# EAGLE design ESP8266_MainBoard (EAGLE 7.3.0)
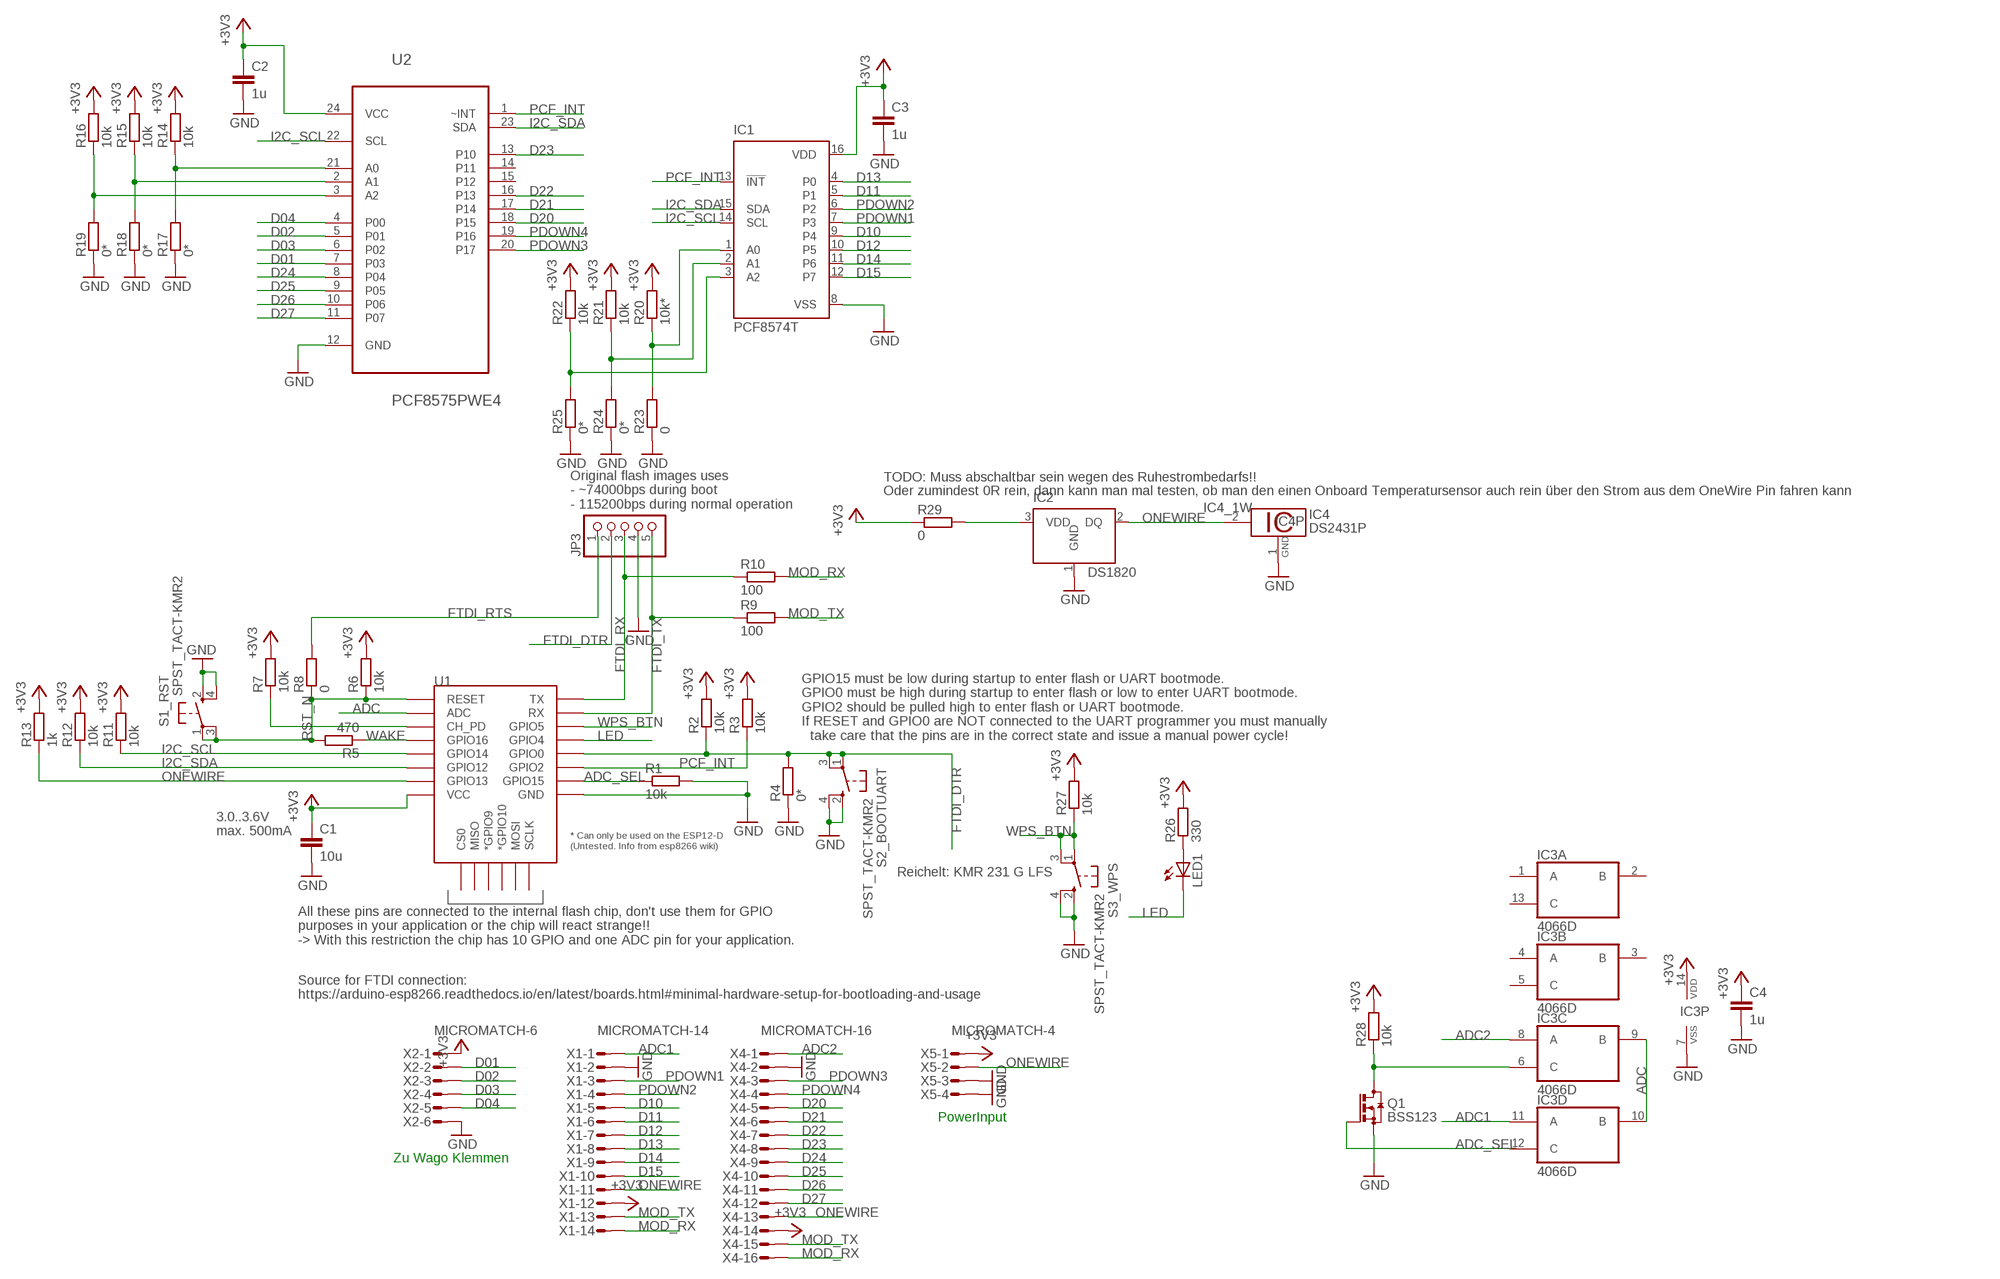
[diagram p0: schematic, sheet 1]

## Parts
C1  10u  C-EUC0805  [C0805]
C2  1u  C-EUC0402  [C0402]
C3  1u  C-EUC0402  [C0402]
C4  1u  C-EUC0402  [C0402]
IC1  PCF8574T  [SO16W]
IC2  DS1820  [TO-92]
IC3  4066D  [SO14]
IC4  DS2431P  [TSOC6]
JP3  PINHD-1X5  [1X05]
LED1  LEDCHIP-LED0603  [CHIP-LED0603]
Q1  BSS123  [SOT23]
R1  10k  R-EU_R0402  [R0402]
R2  10k  R-EU_R0402  [R0402]
R3  10k  R-EU_R0402  [R0402]
R4  0*  R-EU_R0402  [R0402]
R5  470  R-EU_R0402  [R0402]
R6  10k  R-EU_R0402  [R0402]
R7  10k  R-EU_R0402  [R0402]
R8  0  R-EU_R0402  [R0402]
R9  100  R-EU_R0402  [R0402]
R10  100  R-EU_R0402  [R0402]
R11  10k  R-EU_R0402  [R0402]
R12  10k  R-EU_R0402  [R0402]
R13  1k  R-EU_R0402  [R0402]
R14  10k  R-EU_R0402  [R0402]
R15  10k  R-EU_R0402  [R0402]
R16  10k  R-EU_R0402  [R0402]
R17  0*  R-EU_R0402  [R0402]
R18  0*  R-EU_R0402  [R0402]
R19  0*  R-EU_R0402  [R0402]
R20  10k*  R-EU_R0402  [R0402]
R21  10k  R-EU_R0402  [R0402]
R22  10k  R-EU_R0402  [R0402]
R23  0  R-EU_R0402  [R0402]
R24  0*  R-EU_R0402  [R0402]
R25  0*  R-EU_R0402  [R0402]
R26  330  R-EU_R0402  [R0402]
R27  10k  R-EU_R0402  [R0402]
R28  10k  R-EU_R0402  [R0402]
R29  0  R-EU_R0402  [R0402]
S1_RST  SPST_TACT-KMR2  [KMR2]
S2_BOOTUART  SPST_TACT-KMR2  [KMR2]
S3_WPS  SPST_TACT-KMR2  [KMR2]
U1  ESP12ESMD  [ESP12E-SMD]
U2  PCF8575PWE4  [SOP65P640X120-24N]
X1  MICROMATCH-14  [MICROMATCH-14]
X2  MICROMATCH-6  [MICROMATCH-6]
X4  MICROMATCH-16  [MICROMATCH-16]
X5  MICROMATCH-4  [MICROMATCH-4]

## Nets
+3V3: C1.1 C2.1 C3.1 C4.1 IC1.16(VDD) IC3.14(P:VDD) R2.2 R3.2 R6.2 R7.2 R11.2 R12.2 R13.2 R14.2 R15.2 R16.2 R20.2 R21.2 R22.2 R26.2 R27.2 R28.2 R29.1 U1.VCC U2.24(VCC) X1.12 X2.1 X4.14 X5.1
ADC: IC3.9(C:B) IC3.10(D:B) U1.ADC
ADC1: IC3.11(D:A) X1.1
ADC2: IC3.8(C:A) X4.1
ADC_SEL: IC3.12(D:C) Q1.1(G) R1.1 U1.GPIO15
D01: U2.7(P03) X2.2
D02: U2.5(P01) X2.3
D03: U2.6(P02) X2.4
D04: U2.4(P00) X2.5
D10: IC1.9(P4) X1.5
D11: IC1.5(P1) X1.6
D12: IC1.10(P5) X1.7
D13: IC1.4(P0) X1.8
D14: IC1.11(P6) X1.9
D15: IC1.12(P7) X1.10
D20: U2.18(P15) X4.5
D21: U2.17(P14) X4.6
D22: U2.16(P13) X4.7
D23: U2.13(P10) X4.8
D24: U2.8(P04) X4.9
D25: U2.9(P05) X4.10
D26: U2.10(P06) X4.11
D27: U2.11(P07) X4.12
FTDI_DTR: JP3.2 R2.1 R4.2 S2_BOOTUART.1(P) S2_BOOTUART.3(P1) U1.GPIO0
FTDI_RTS: JP3.1 R8.2
FTDI_RX: JP3.3 R10.1 U1.TXD0(TX)
FTDI_TX: JP3.5 R9.1 U1.RXD0(RX)
GND: C1.2 C2.2 C3.2 C4.2 IC1.8(VSS) IC2.1(GND) IC3.7(P:VSS) IC4.1(GND) JP3.4 Q1.2(S) R1.2 R4.1 R17.1 R18.1 R19.1 R23.1 R24.1 R25.1 S1_RST.2(S) S1_RST.4(S1) S2_BOOTUART.2(S) S2_BOOTUART.4(S1) S3_WPS.2(S) S3_WPS.4(S1) U1.GND U2.12(GND) X1.2 X2.6 X4.2 X5.3 X5.4
I2C_SCL: IC1.14(SCL) R11.1 U1.GPIO14 U2.22(SCL)
I2C_SDA: IC1.15(SDA) R12.1 U1.GPIO12 U2.23(SDA)
LED: LED1.C U1.GPIO4
MOD_RX: R10.2 X1.14 X4.16
MOD_TX: R9.2 X1.13 X4.15
N$1: IC3.6(C:C) Q1.3(D) R28.1
N$2: R14.1 R17.2 U2.21(A0)
N$3: R15.1 R18.2 U2.2(A1)
N$4: R7.1 U1.CH_PD
N$5: IC2.3(VDD) R29.2
N$21: R16.1 R19.2 U2.3(A2)
N$25: IC1.1(A0) R20.1 R23.2
N$26: IC1.2(A1) R21.1 R24.2
N$27: IC1.3(A2) R22.1 R25.2
N$33: LED1.A R26.1
ONEWIRE: IC2.2(DQ) IC4.2(1W) R13.1 U1.GPIO13 X1.11 X4.13 X5.2
PCF_INT: IC1.13(!INT) R3.1 U1.GPIO2 U2.1(~INT)
PDOWN1: IC1.7(P3) X1.3
PDOWN2: IC1.6(P2) X1.4
PDOWN3: U2.20(P17) X4.3
PDOWN4: U2.19(P16) X4.4
RST_N: R5.2 R6.1 R8.1 S1_RST.1(P) S1_RST.3(P1) U1.RESET
WAKE: R5.1 U1.GPIO16
WPS_BTN: R27.1 S3_WPS.1(P) S3_WPS.3(P1) U1.GPIO5
Unconnected: IC3.1(A:A) IC3.2(A:B) IC3.3(B:B) IC3.4(B:A) IC3.5(B:C) IC3.13(A:C) U1.CS0 U1.GPIO9(*GPIO9) U1.GPIO10(*GPIO10) U1.MISO U1.MOSI U1.SCLK U2.14(P11) U2.15(P12)

## Notes on the sheet
- TODO: Muss abschaltbar sein wegen des Ruhestrombedarfs!!
- Oder zumindest 0R rein, dann kann man mal testen, ob man den einen Onboard Temperatursensor auch rein über den Strom aus dem OneWire Pin fahren kann
- Original flash images uses
  - ~74000bps during boot
  - 115200bps during normal operation
- GPIO15 must be low during startup to enter flash or UART bootmode.
  GPIO0 must be high during startup to enter flash or low to enter UART bootmode.
  GPIO2 should be pulled high to enter flash or UART bootmode.
  If RESET and GPIO0 are NOT connected to the UART programmer you must manually
    take care that the pins are in the correct state and issue a manual power cycle!
- 3.0..3.6V
  max. 500mA
- Reichelt: KMR 231 G LFS
- All these pins are connected to the internal flash chip, don't use them for GPIO
  purposes in your application or the chip will react strange!!
  -> With this restriction the chip has 10 GPIO and one ADC pin for your application.
- Source for FTDI connection:
  https://arduino-esp8266.readthedocs.io/en/latest/boards.html#minimal-hardware-setup-for-bootloading-and-usage
- PowerInput
- Zu Wago Klemmen

## Library data of the parts
C1-C4 = rcl:C-EU: CAPACITOR, European symbol
IC1 = micro-philips:PCF8574: I2C-Bus Remote 8-bit I/O expander http://www.semiconductors.philips.com/acrobat_download/datasheets/PCF8574_4.pdf; MPN: PCF8574T/3,512; OC_FARNELL: 1201255; OC_NEWARK: 70R6870
IC2 = DS1820:DS1820: DS1820 - 1-Wire Digital Thermometer
IC3 = 40xx:4066: Quad bilateral ANALOG SWITCH
IC4 = 1wire:DS2431: 1024-Bit EEPROM This chip provides a 4x256 Bit EEPROM, which can be programmed@5V. Write protection and OTP emulation are available, too. Author: Jan Kandziora <jjj@gmx.de>
JP3 = pinhead:PINHD-1X5: PIN HEADER
LED1 = adafruit:LED: LED OSRAM: - CHIPLED LG R971, LG N971, LY N971, LG Q971, LY Q971, LO R971, LY R971 LH N974, LH R974 LS Q976, LO Q976, LY Q976 LO Q996 - Hyper CHIPLED LW Q18S LB Q993, LB Q99A, LB R99A - SideLED LS A670, LO A670, LY A670, LG A670, LP A670 LB A673, LV A673, LT A673, LW A673 LH A674 LY A675 LS A676, LA A676, LO A676, LY A676, LW A676 LS A679, LY A679, LG A679 - Hyper Micro SIDELED® LS Y876, LA Y876, LO Y876, LY Y876 LT Y87S - SmartLED LW L88C, LW L88S LB L89C, LB L89S, LG L890 LS L89K, LO L89K, LY L89K LS L896, LA L896, LO L896, LY L896 - TOPLED LS T670, LO T670, LY T670, LG T670, LP T670 LSG T670, LSP T670, LSY T670, LOP T670, LYG T670 LG T671, LOG T671, LSG T671 LB T673, LV T673, LT T673, LW T673 LH T674 LS T676, LA T676, LO T676, LY T676, LB T676, LH T676, LSB T676, LW T676 LB T67C, LV T67C, LT T67C, LS T67K, LO T67K, LY T67K, LW E67C LS E67B, LA E67B, LO E67B, LY E67B, LB E67C, LV E67C, LT E67C LW T67C LS T679, LY T679, LG T679 LS T770, LO T770, LY T770, LG T770, LP T770 LB T773, LV T773, LT T773, LW T773 LH T774 LS E675, LA E675, LY E675, LS T675 LS T776, LA T776, LO T776, LY T776, LB T776 LHGB T686 LT T68C, LB T68C - Hyper Mini TOPLED® LB M676 - Mini TOPLED Santana® LG M470 LS M47K, LO M47K, LY M47K Source: http://www.osram.convergy.de/
Q1 = transistor-small-signal:BSS123: N-CHANNEL MOS FET
R1-R29 = rcl:R-EU_: RESISTOR, European symbol
S1_RST S2_BOOTUART S3_WPS = adafruit:SPST_TACT: SMT 6mm switch, EVQQ2 series http://www.ladyada.net/library/eagle
U1 = esp8266modules:ESP12E: ESP12E Module
U2 = PCF8575PWE4:PCF8575PWE4: REMOTE 16-BIT I2C AND SMBus I/O EXPANDER; AVAILABILITY: Good; DESCRIPTION: emote 16-Bit I2C and SMBus I/O Expander with Interrupt Output 24-TSSOP -40 to 85; MF: Texas Instruments; MP: PCF8575PWE4; PACKAGE: TSSOP-24 Texas Instruments; PRICE: 1.39 USD
X1 = con-amp-micromatch:MICROMATCH-14: MicroMaTch 14 8-215464-4 / 1-215464-4 Drawing Number C-215464 DDEController.pdf; MF: FARNELL; MPN: 8-215464-4; OC_FARNELL: 3784678; OC_NEWARK: 19J6431
X2 = con-amp-micromatch:MICROMATCH-6: MicroMaTch 6 7-215464-6 / 0-215464-6 Drawing Number C-215464 DDEController.pdf; MPN: 7-215464-6; OC_FARNELL: 3784630; OC_NEWARK: 19R8125
X4 = con-amp-micromatch:MICROMATCH-16: MicroMaTch 16 8-215464-6 / 1-215464-6 Drawing Number C-215464 DDEController.pdf; MF: FARNELL; MPN: 8-215464-6; OC_FARNELL: 3784680; OC_NEWARK: 26H3309
X5 = con-amp-micromatch:MICROMATCH-4: MicroMaTch 4 7-215464-4 / 0-215464-4 Drawing Number C-215464 DDEController.pdf; MPN: 7-215464-4; OC_FARNELL: 3784629; OC_NEWARK: 19R8124

## Board
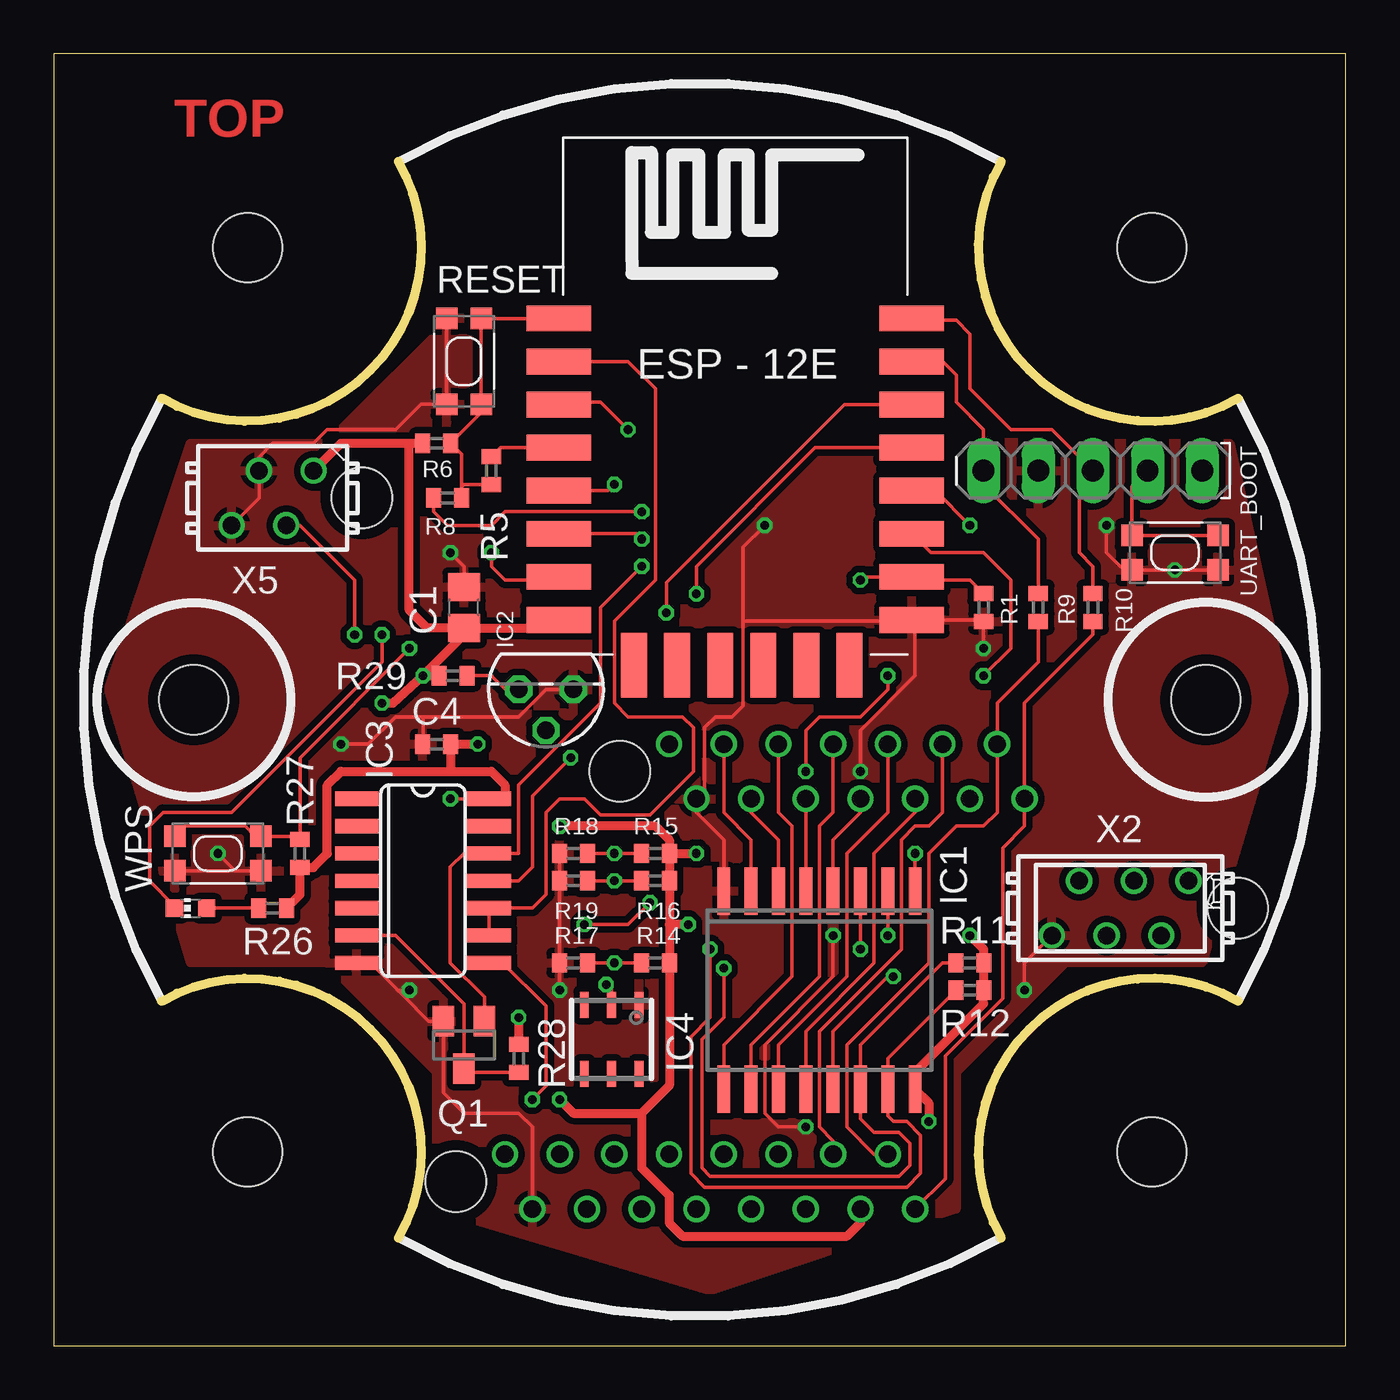
[diagram p1: board, top side]
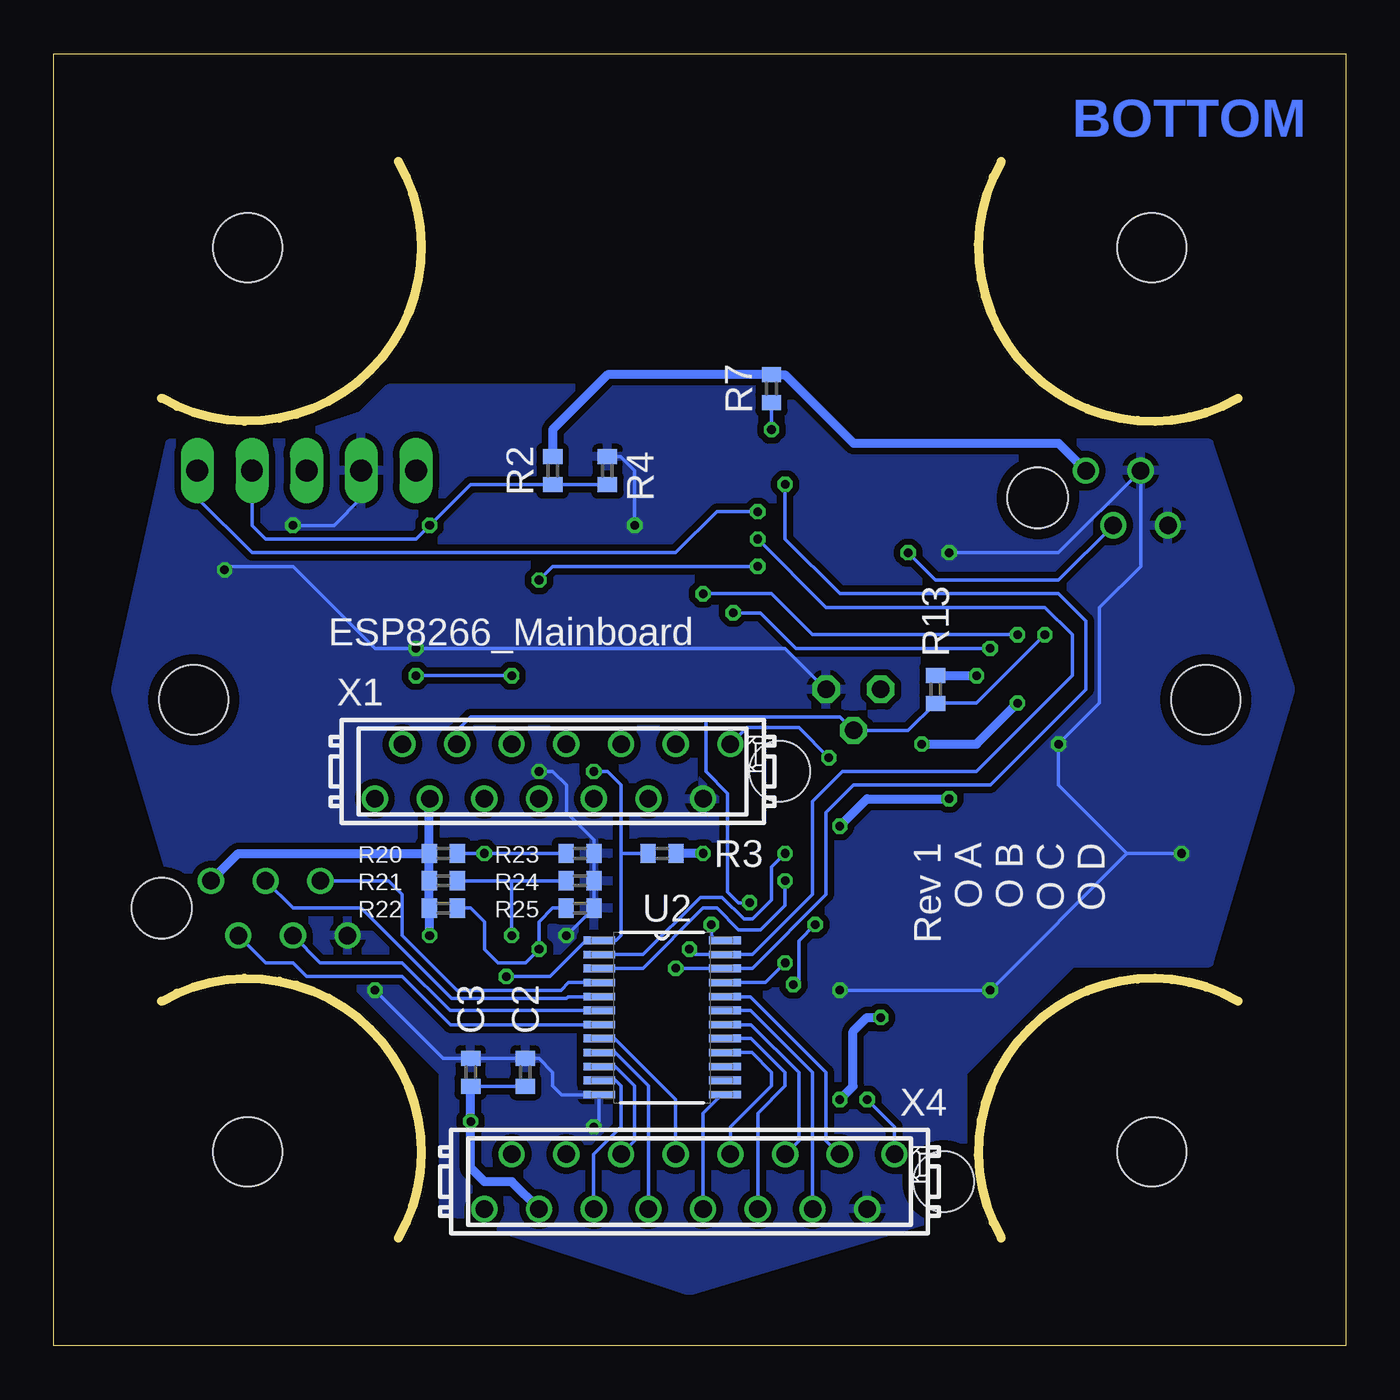
[diagram p2: board, bottom side, seen from below]

Size 60 x 60 mm. Coordinates in mm from the lower left corner, seen from the top.
Outline: 0,0 60,0 60,60 0,60 0,0
Copper layers (1*16): Top 0.035mm / dielectric 1.6mm / Bottom 0.035mm
Design rules "Elecrow_2-layer_PCB_eagle_rule": minimum track width 6mil, minimum drill 12mil, track to track 6mil, track to pad 6mil, pad to pad 6mil, via to via 8mil, smd to smd 0mil, copper to edge 20mil, drill to drill 10mil, minimum pad ring 6mil, minimum via ring 6mil, stop-mask expansion 0mil, vias tented up to drill 100mil, thermal gap 10mil
Holes 3.2 mm at 9,51 51,51 51,9 9,9 6.5,30 53.5,30
Holes 2.8 mm at 14.3,39.37 54.99,20.32 26.29,26.67 18.67,7.62
Milling: 4 lines

### Footprints (pad centres in the part's own frame; a part is rotated, then mirrored left to right if it is on the bottom)
C0805 = smd 1.3 x 1.5: 1 -0.95,0; 2 0.95,0
C0402 = smd 0.7 x 0.9: 1 -0.65,0; 2 0.65,0
SO16W = smd 0.6 x 2.2: 1 -4.445,-4.6; 2 -3.175,-4.6; 3 -1.905,-4.6; 4 -0.635,-4.6; 5 0.635,-4.6; 6 1.905,-4.6; 7 3.175,-4.6; 8 4.445,-4.6; 9 4.445,4.6; 10 3.175,4.6; 11 1.905,4.6; 12 0.635,4.6; 13 -0.635,4.6; 14 -1.905,4.6; 15 -3.175,4.6; 16 -4.445,4.6
TO-92 = drill 0.813 pad 1.27 octagon: 1 -1.27,0; 2 0,1.905; 3 1.27,0
SO14 = smd 0.66 x 2.032: 1 -3.81,-3.073; 2 -2.54,-3.073; 3 -1.27,-3.073; 4 0,-3.073; 5 1.27,-3.073; 6 2.54,-3.073; 7 3.81,-3.073; 8 3.81,3.073; 9 2.54,3.073; 10 1.27,3.073; 11 0,3.073; 12 -1.27,3.073; 13 -2.54,3.073; 14 -3.81,3.073
TSOC6 = smd 0.406 x 1.219: 1 -1.27,-1.6; 2 0,-1.6; 3 1.27,-1.6; 4 1.27,1.6; 5 0,1.6; 6 -1.27,1.6
1X05 = drill 1.016 long: 1 -5.08,0; 2 -2.54,0; 3 0,0; 4 2.54,0; 5 5.08,0
CHIP-LED0603 = smd 0.8 x 0.8: A 0,-0.75; C 0,0.75
SOT23 = smd 1 x 1.4: 1 -0.95,-1.1; 2 0.95,-1.1; 3 0,1.1
R0402 = smd 0.7 x 0.9: 1 -0.65,0; 2 0.65,0
KMR2 = smd 1 x 1: 1 2,0.8; 2 2,-0.8; 3 -2,0.8; 4 -2,-0.8
ESP12E-SMD = smd 3 x 1.2: ADC -8.3,3.8; CH_PD -8.3,1.8; GND 8.1,-8.2; GPIO0 8.1,-2.2; GPIO2 8.1,-4.2; GPIO4 8.1,-0.2; GPIO5 8.1,1.8; GPIO12 -8.3,-4.2; GPIO13 -8.3,-6.2; GPIO14 -8.3,-2.2; GPIO15 8.1,-6.2; GPIO16 -8.3,-0.2; RESET -8.3,5.8; RXD0 8.1,3.8; TXD0 8.1,5.8; VCC -8.3,-8.2 | smd 1.2 x 3: CS0 -4.8,-10.3; GPIO9 -0.8,-10.3; GPIO10 1.2,-10.3; MISO -2.8,-10.3; MOSI 3.2,-10.3; SCLK 5.2,-10.3
SOP65P640X120-24N = smd 1.473 x 0.356: 1 -2.921,3.581; 2 -2.921,2.921; 3 -2.921,2.286; 4 -2.921,1.626; 5 -2.921,0.965; 6 -2.921,0.33; 7 -2.921,-0.33; 8 -2.921,-0.965; 9 -2.921,-1.626; 10 -2.921,-2.286; 11 -2.921,-2.921; 12 -2.921,-3.581; 13 2.921,-3.581; 14 2.921,-2.921; 15 2.921,-2.286; 16 2.921,-1.626; 17 2.921,-0.965; 18 2.921,-0.33; 19 2.921,0.33; 20 2.921,0.965; 21 2.921,1.626; 22 2.921,2.286; 23 2.921,2.921; 24 2.921,3.581
MICROMATCH-14 = drill 0.813: 1 8.255,1.27; 2 6.985,-1.27; 3 5.715,1.27; 4 4.445,-1.27; 5 3.175,1.27; 6 1.905,-1.27; 7 0.635,1.27; 8 -0.635,-1.27; 9 -1.905,1.27; 10 -3.175,-1.27; 11 -4.445,1.27; 12 -5.715,-1.27; 13 -6.985,1.27; 14 -8.255,-1.27
MICROMATCH-6 = drill 0.813: 1 3.175,1.27; 2 1.905,-1.27; 3 0.635,1.27; 4 -0.635,-1.27; 5 -1.905,1.27; 6 -3.175,-1.27
MICROMATCH-16 = drill 0.813: 1 9.525,1.27; 2 8.255,-1.27; 3 6.985,1.27; 4 5.715,-1.27; 5 4.445,1.27; 6 3.175,-1.27; 7 1.905,1.27; 8 0.635,-1.27; 9 -0.635,1.27; 10 -1.905,-1.27; 11 -3.175,1.27; 12 -4.445,-1.27; 13 -5.715,1.27; 14 -6.985,-1.27; 15 -8.255,1.27; 16 -9.525,-1.27
MICROMATCH-4 = drill 0.813: 1 1.905,1.27; 2 0.635,-1.27; 3 -0.635,1.27; 4 -1.905,-1.27

### Placement (x,y rotation side)
C1  19.05,34.29 90 top
C2  38.1,12.7 90 bottom
C3  40.64,12.7 90 bottom
C4  17.78,27.94 180 top
IC1  35.56,16.51 180 top
IC2  22.86,30.48 180 top
IC3  17.14,21.59 270 top
IC4  25.91,14.22 180 top
JP3  48.26,40.64 180 top
LED1  6.35,20.32 90 top
Q1  19.05,13.97 180 top
R1  43.18,34.29 270 top
R2  36.83,40.64 90 bottom
R3  31.75,22.86 0 bottom
R4  34.29,40.64 270 bottom
R5  20.32,40.64 270 top
R6  17.78,41.91 180 top
R7  26.67,44.45 90 bottom
R8  18.29,39.37 180 top
R9  45.72,34.29 270 top
R10  48.26,34.29 270 top
R11  42.55,17.78 0 top
R12  42.55,16.51 0 top
R13  19.05,30.48 90 bottom
R14  27.94,17.78 0 top
R15  27.94,22.86 0 top
R16  27.94,21.59 0 top
R17  24.13,17.78 0 top
R18  24.13,22.86 0 top
R19  24.13,21.59 0 top
R20  41.91,22.86 180 bottom
R21  41.91,21.59 180 bottom
R22  41.91,20.32 180 bottom
R23  35.56,22.86 180 bottom
R24  35.56,21.59 180 bottom
R25  35.56,20.32 180 bottom
R26  10.16,20.32 0 top
R27  11.43,22.86 270 top
R28  21.59,13.34 90 top
R29  18.54,31.11 0 top
S1_RST  19.05,45.72 270 top
S2_BOOTUART  52.07,36.83 0 top
S3_WPS  7.62,22.86 0 top
U1  31.75,41.91 0 top
U2  31.75,15.24 0 bottom
X1  36.83,26.67 0 bottom
X2  49.53,20.32 0 top
X4  30.48,7.62 0 bottom
X5  10.16,39.37 0 top

### Tracks (layer width: path | path; a pad name or v marks a point on that pad's centre or on a via)
+3V3  (via drill 0.4)
  Top 0.152: IC1.16 40.01,12.7 | 43.18,16.5 R12.2 | R26.2 10.81,20.34 | 20.95,25.5 IC3.14 v18.41,25.4 | 18.43,26.68 18.41,26.67 | 23.08,33.34 U1.VCC | C1.1 19.05,33.02
  Top 0.406: 40.01,12.7 43.18,15.88 43.18,16.5 | R12.2 R11.2 43.2,18.4 v42.55,19.05 | IC1.16 40.64,11.28 v40.64,10.41 | 27.3,10.79 28.59,12.08 R14.2 28.59,19.56 | 27.3,10.79 27.3,8.26 28.57,6.99 28.57,5.71 29.21,5.08 36.83,5.08 37.47,5.71 X4.14 | v23.5,11.43 24.13,10.79 27.3,10.79 | 28.59,19.56 R16.2 R15.2 | 10.81,20.34 11.43,20.95 R27.2 12.05,22.21 12.7,22.86 12.7,26.04 13.34,26.67 18.41,26.67 20.32,26.67 20.95,26.04 20.95,25.5 | 18.43,26.68 C4.1 v19.68,27.94 | 23.08,33.34 C1.1 17.33,33.34 16.51,34.16 16.51,41.91 | R15.2 v29.84,22.86 | v23.5,24.13 27.94,24.13 28.59,23.48 R15.2 | v17.14,31.11 R29.1 | 19.05,33.02 v17.14,31.11 | X5.1 13.34,41.91 16.51,41.91 | 16.51,41.91 R6.2 | v15.24,29.84 15.75,29.84 v17.14,31.11 | v21.59,15.24 R28.2 | v29.46,19.56 28.59,19.56
  Bottom 0.152: 42.55,20.3 R22.2 | 42.56,25.39 X1.12 | C2.1 C3.1 | 19.07,31.11 R13.2 19.04,31.11 | U2.24 29.23,18.82 29.46,19.05 v29.46,19.56
  Bottom 0.406: v42.55,19.05 42.55,20.3 | R22.2 R21.2 R20.2 | R20.2 42.56,25.39 | X2.1 51.44,22.86 R20.2 | X4.14 38.73,7.62 40.01,7.62 40.64,8.26 v40.64,10.41 C3.1 | v23.5,11.43 22.88,12.05 22.88,14.59 22.23,15.24 v21.59,15.24 | R2.2 36.83,42.55 34.27,45.1 R7.2 26.05,45.1 22.86,41.91 13.34,41.91 X5.1 | v29.84,22.86 R3.2 | v23.5,24.13 22.23,25.4 v18.41,25.4 | 19.04,31.11 v17.14,31.11 | v19.68,27.94 17.14,27.94 v15.24,29.84
ADC
  Top 0.152: IC3.9 IC3.10 22.23,20.32 22.86,20.95 22.86,24.77 23.5,25.4 24.64,25.4 25.4,24.64 27.69,24.64 29.72,26.67 29.72,28.7 29.21,29.21 26.67,29.21 26.04,29.84 26.04,33.66 27.94,35.56 27.94,44.45 26.68,45.71 U1.ADC
ADC1  (via drill 0.4)
  Top 0.152: IC3.11 21.59,21.59 22.23,22.23 22.23,25.53 v24,27.3
  Bottom 0.152: v24,27.3 25.4,28.7 27.81,28.7 X1.1
ADC2  (via drill 0.4)
  Top 0.152: v22.23,11.43 22.86,12.06 22.86,15.77 20.85,17.78 IC3.8
  Bottom 0.152: v22.23,11.43 20.95,10.16 X4.1
ADC_SEL  (via drill 0.4)
  Top 0.152: R1.1 43.16,34.94 42.55,35.56 40,35.56 U1.GPIO15 37.62,35.71 v37.47,35.56 | v27.3,36.2 25.4,34.29 25.4,29.84 21.59,26.04 21.59,22.86 IC3.12 19.05,22.86 18.41,22.23 18.41,17.78 20,16.2 Q1.1
  Bottom 0.152: v27.3,36.2 36.83,36.2 v37.47,35.56
D01
  Bottom 0.152: U2.7 41.58,14.91 43.81,17.14 48.26,17.14 48.9,17.78 50.16,17.78 X2.2
D02
  Bottom 0.152: X2.3 48.9,20.32 45.72,20.32 41.53,16.13 36.2,16.13 36.12,16.2 U2.5
D03
  Bottom 0.152: U2.6 41.6,15.57 43.81,17.78 47.62,17.78 X2.4
D04
  Bottom 0.152: X2.5 44.45,21.59 43.81,20.95 43.81,19.05 41.27,16.51 36.45,16.51 36.09,16.87 U2.4
D10
  Top 0.152: X1.5 33.66,24.77 34.29,24.13 34.29,17.14 31.11,13.97 IC1.9
D11
  Top 0.152: X1.6 IC1.5
D12
  Top 0.152: X1.7 36.2,24.77 35.56,24.13 35.56,17.14 32.38,13.97 IC1.10
D13
  Top 0.152: X1.8 37.47,24.77 36.2,23.5 IC1.4
D14
  Top 0.152: X1.9 38.73,24.77 36.83,22.86 36.83,17.14 33.66,13.97 IC1.11
D15
  Top 0.152: X1.10 40.01,24.77 38.1,22.86 38.1,17.78 34.92,14.61 IC1.12
D20
  Bottom 0.152: U2.18 27.61,14.91 25.4,12.7 25.4,9.53 X4.5
D21
  Bottom 0.152: U2.17 27.61,14.28 26.04,12.7 26.04,12.06 27.3,10.79 X4.6
D22
  Bottom 0.152: U2.16 27.58,13.61 26.67,12.7 26.67,12.06 28.57,10.16 X4.7
D23
  Bottom 0.152: U2.13 28.98,11.66 29.84,10.79 X4.8
D24
  Bottom 0.152: X4.9 31.11,11.43 33.96,14.28 U2.8
D25
  Bottom 0.152: X4.10 32.38,12.06 33.93,13.61 U2.9
D26
  Bottom 0.152: X4.11 33.02,9.53 33.02,12.06 33.91,12.95 U2.10
D27
  Bottom 0.152: U2.11 33.91,12.32 33.66,12.06 33.66,10.16 34.92,8.89 X4.12
FTDI_DTR  (via drill 0.4)
  Top 0.152: JP3.2 50.07,39.91 S2_BOOTUART.3 S2_BOOTUART.1 | U1.GPIO0 40.94,39.71 v42.55,38.1
  Bottom 0.152: R4.2 R2.1 40.66,39.99 v42.55,38.1 43.18,37.47 50.16,37.47 50.8,38.1 JP3.2
FTDI_RTS  (via drill 0.4)
  Top 0.152: v27.3,38.73 20.95,38.73 20.32,38.1 18.29,38.1 17.64,38.75 R8.2
  Bottom 0.152: JP3.1 53.34,39.37 50.8,36.83 31.11,36.83 29.21,38.73 v27.3,38.73
FTDI_RX
  Top 0.152: U1.TXD0 39.94,47.62 41.91,47.62 42.55,46.99 42.55,44.45 44.45,42.55 46.35,42.55 JP3.3 48.26,40.01 47.62,39.37 47.62,36.83 48.26,36.2 R10.1
FTDI_TX
  Top 0.152: U1.RXD0 41.27,45.72 41.91,45.09 41.91,43.81 43.18,42.55 JP3.5 43.18,40.01 45.72,37.47 R9.1
GND  (via drill 0.4)
  Top 0.152: IC1.8 31.11,23.5 29.84,24.77 X1.2 30.23,25.78 30.23,28.7 30.73,29.21 31.5,29.21 32,29.72 32,33.66 | v45.09,16.51 45.09,17.78 X2.6 | X4.2 22.23,10.16 21.59,10.79 19.05,10.79 18.1,11.74 Q1.2 17.42,15.07 16.24,16.24 | S3_WPS.4 S3_WPS.2 8.42,22.06 v7.62,22.86 | 15.98,16.51 v16.51,16.51 16.24,16.24 | S1_RST.4 S1_RST.2 17.05,43.72 15.88,42.55 12.7,42.55 12.06,41.91 10.16,41.91 9.53,41.27 X5.3 9.53,39.37 X5.4 | C1.2 19.05,36.2 v18.41,36.83 | S2_BOOTUART.2 v52.07,36.03 S2_BOOTUART.4 49.91,36.2 49.53,36.2 48.9,36.83 v48.9,38.1 | U1.GND 43.11,33.71 R1.2 v43.18,32.38 | U1.GND 40.01,33.55 40.01,31.11 37.47,28.57 v37.47,26.67 | C4.2 17.14,27.95 17.14,29.21 | 17.14,29.21 15.88,29.21 14.61,27.94 v13.34,27.94 | 17.14,29.21 21.59,29.21 22.86,30.48 IC2.1 | R18.1 R19.1 R17.1 23.5,17.77 v23.5,16.51 | v36.2,19.05 36.2,17.14 33.02,13.97 33.02,10.79 33.66,10.16 v34.92,10.16 | U1.GND 39.8,33.66 32,33.66 | v33.02,38.1 32,37.08 32,33.66 | 16.24,16.24 14.71,17.78 IC3.7
  Bottom 0.152: 40.62,13.34 C3.2 | C3.2 41.92,13.35 v45.09,16.51 | C3.2 C2.2 38.09,13.34 37.47,13.34 36.83,12.7 36.83,12.06 36.42,11.66 U2.12 34.67,10.41 v34.92,10.16 | v7.62,22.86 10.16,22.86 | 10.16,22.86 v16.51,16.51 v23.5,16.51 | v18.41,36.83 13.34,36.83 X5.3 9.53,36.2 11.43,34.29 11.43,29.84 v13.34,27.94 13.34,26.04 10.16,22.86 | v52.07,36.03 51.91,36.2 48.9,36.2 45.09,32.38 v43.18,32.38 26.04,32.38 IC2.1 | JP3.4 45.72,39.37 46.99,38.1 v48.9,38.1 | v37.47,26.67 36.83,26.67 36.2,26.04 36.2,24.77 34.91,23.48 R23.1 R24.1 R25.1 36.18,19.05 v36.2,19.05 | v33.02,38.1 33.02,40.64 33.67,41.29 R4.1
  pour Top (isolate 0.305): 6.35,17.78 2.54,30.48 6.35,41.91 12.7,41.91 19.05,48.26 25.4,48.26 25.4,44.45 38.1,44.45 38.1,48.26 41.91,48.26 45.72,43.18 49.53,41.91 54.61,41.91 57.15,30.48 53.34,17.78 46.99,17.78 41.91,12.7 41.91,6.35 30.48,2.54 17.78,6.35 17.78,12.7 12.7,17.78
  pour Bottom (isolate 0.305): 6.35,41.91 12.7,41.91 15.24,44.45 44.45,44.45 45.72,43.18 49.53,41.91 54.61,41.91 57.15,30.48 53.34,17.78 46.99,17.78 41.91,12.7 41.91,6.35 30.48,2.54 17.78,6.35 17.78,12.7 12.7,17.78 6.35,17.78 2.54,30.48
I2C_SCL  (via drill 0.4)
  Top 0.152: R11.1 41.27,17.78 37.47,13.97 IC1.14 37.47,10.54 38.1,9.91 39.24,9.91 39.75,9.4 39.75,8.38 39.24,7.87 30.48,7.87 30.1,8.26 30.1,14.22 31.11,15.24 v31.11,17.53 | v26.04,40.01 25.74,39.71 U1.GPIO14
  Bottom 0.152: v31.11,17.53 U2.22 27.56,17.53 24.13,20.95 24.13,24.77 22.86,26.04 16.51,26.04 12.06,30.48 12.06,33.66 13.34,34.92 23.5,34.92 26.04,37.47 v26.04,40.01
I2C_SDA  (via drill 0.4)
  Top 0.152: R12.1 39.38,14 39.38,13.98 38.73,13.34 IC1.15 38.73,10.67 38.99,10.41 39.62,10.41 40.26,9.78 40.26,8 39.62,7.37 30.23,7.37 29.59,8 29.59,14.35 30.48,15.24 v30.48,18.41 | v27.3,37.47 27.06,37.71 U1.GPIO12
  Bottom 0.152: v30.48,18.41 30.23,18.16 U2.23 27.56,18.16 24.77,20.95 24.77,25.27 23.37,26.67 17.14,26.67 12.7,31.11 12.7,33.02 13.97,34.29 24.13,34.29 v27.3,37.47
LED  (via drill 0.4)
  Top 0.152: LED1.C 5.6,20.43 4.45,21.59 4.45,24.13 5.08,24.77 8.26,24.77 15.24,31.75 v15.24,33.02 | U1.GPIO4 35.36,41.71 29.84,36.2 v29.84,34.92
  Bottom 0.152: v15.24,33.02 24.77,33.02 26.67,34.92 v29.84,34.92
MOD_RX
  Top 0.152: X4.16 41.4,7.75 41.4,13.46 44.07,16.13 44.07,23.11 45.09,24.13 X1.14 45.09,29.84 48.26,33.02 R10.2
MOD_TX
  Top 0.152: X4.15 38.1,8.89 36.83,10.16 36.83,13.97 40.64,17.78 40.64,22.86 41.91,24.13 43.18,24.13 43.81,24.77 X1.13 43.81,29.84 45.72,31.75 R9.2
N$1
  Top 0.152: R28.1 21.57,12.7 19.22,12.7 Q1.3 19.05,15.88 15.88,19.05 IC3.6
N$2  (via drill 0.4)
  Top 0.152: R14.1 v26.04,17.78 R17.2
  Bottom 0.152: U2.21 26.95,16.87 v26.04,17.78
N$3  (via drill 0.4)
  Top 0.152: R18.2 v26.04,22.86 R15.1
  Bottom 0.152: U2.2 32.64,18.16 29.97,20.83 28.96,20.83 27.94,19.81 27.56,19.81 26.67,20.7 26.67,22.23 v26.04,22.86
N$4  (via drill 0.4)
  Top 0.152: v26.67,42.55 25.4,43.81 23.55,43.81 U1.CH_PD
  Bottom 0.152: R7.1 v26.67,42.55
N$5
  Top 0.152: R29.2 20.32,31.11 20.45,30.99 20.97,30.48 IC2.3
N$21  (via drill 0.4)
  Top 0.152: R19.2 v26.04,21.59 R16.1
  Bottom 0.152: U2.3 32.64,17.53 29.84,20.32 29.21,20.32 28.19,19.3 27.18,19.3 26.04,20.45 v26.04,21.59
N$25  (via drill 0.4)
  Top 0.152: v40.01,22.86 IC1.1
  Bottom 0.152: R20.1 v40.01,22.86 R23.2
N$26  (via drill 0.4)
  Top 0.152: v38.73,19.05 IC1.2
  Bottom 0.152: 38.73,21.59 v38.73,19.05 | R24.2 38.73,21.59 | 38.73,21.59 R21.1
N$27  (via drill 0.4)
  Top 0.152: v37.47,18.41 IC1.3
  Bottom 0.152: R22.1 40.64,20.32 40.01,19.68 40.01,18.41 39.37,17.78 38.1,17.78 v37.47,18.41 37.47,19.68 36.83,20.32 R25.2
N$33
  Top 0.152: LED1.A R26.1
ONEWIRE  (via drill 0.4)
  Top 0.152: X4.13 36.2,9.53 35.56,10.16 35.56,14.61 39.37,18.41 39.37,23.5 40.01,24.13 40.64,24.13 41.27,24.77 X1.11 | U1.GPIO13 23.3,35.56 20.95,35.56 20.32,36.2 v20.32,36.83 | v13.97,33.02 13.97,35.56 11.43,38.1 X5.2 | IC4.2 25.91,16.51 v25.65,16.76 | v24.64,19.56 26.67,19.56 v27.69,20.57
  Bottom 0.152: 29.72,29.21 23.5,29.21 IC2.2 20.32,28.57 19.07,29.83 R13.1 19.04,29.84 17.14,29.84 v13.97,33.02 | 29.72,29.21 40.64,29.21 41.27,28.57 X1.11 | v20.32,36.83 19.05,35.56 13.34,35.56 X5.2 | v25.65,16.76 25.4,16.76 25.4,18.8 v24.64,19.56 | v27.69,20.57 28.19,20.57 28.7,21.08 28.7,25.65 29.72,26.67 29.72,29.21
PCF_INT  (via drill 0.4)
  Top 0.152: IC1.13 36.2,14.61 38.73,17.14 v38.99,17.14 | U1.GPIO2 40.73,36.83 43.18,36.83 44.45,35.56 44.45,32.38 v43.18,31.11 | v34.92,26.67 34.92,28.57 35.56,29.21 37.47,29.21 38.73,30.48 v38.73,31.11
  Bottom 0.152: v38.99,17.14 36.96,17.14 35.28,18.82 U2.1 33.88,18.82 33.66,19.05 33.66,22.86 | 33.66,22.86 33.66,26.04 34.29,26.67 v34.92,26.67 | v38.73,31.11 v43.18,31.11 | R3.1 33.66,22.86
PDOWN1
  Top 0.152: X1.3 31.11,24.77 32.38,23.5 IC1.7
PDOWN2
  Top 0.152: X1.4 32.38,24.77 33.66,23.5 IC1.6
PDOWN3
  Bottom 0.152: U2.20 27.64,16.2 24.13,12.7 24.13,9.53 X4.3
PDOWN4
  Bottom 0.152: U2.19 27.64,15.57 24.77,12.7 X4.4
RST_N
  Top 0.152: U1.RESET S1_RST.3 S1_RST.1 19.85,43.33 R6.1 18.94,41.4 R8.1 18.94,39.88 19.05,39.99 R5.2
WAKE
  Top 0.152: U1.GPIO16 20.74,41.71 R5.1
WPS_BTN  (via drill 0.4)
  Top 0.152: v16.51,32.38 11.43,27.3 R27.1 11.25,23.66 S3_WPS.1 9.36,23.66 8.89,24.13 6.09,24.13 S3_WPS.3 | U1.GPIO5 36.73,43.71 28.45,35.43 v28.45,34.04
  Bottom 0.152: v16.51,32.38 25.53,32.38 27.18,34.04 v28.45,34.04

### Text on the board
Top: TOP
Bottom: BOTTOM
tNames: RESET | UART_BOOT | WPS
bNames: ESP8266_Mainboard | Rev 1 / O A / O B / O C / O D